# EAGLE design AlmosFinalMC (EAGLE 7.5.0)
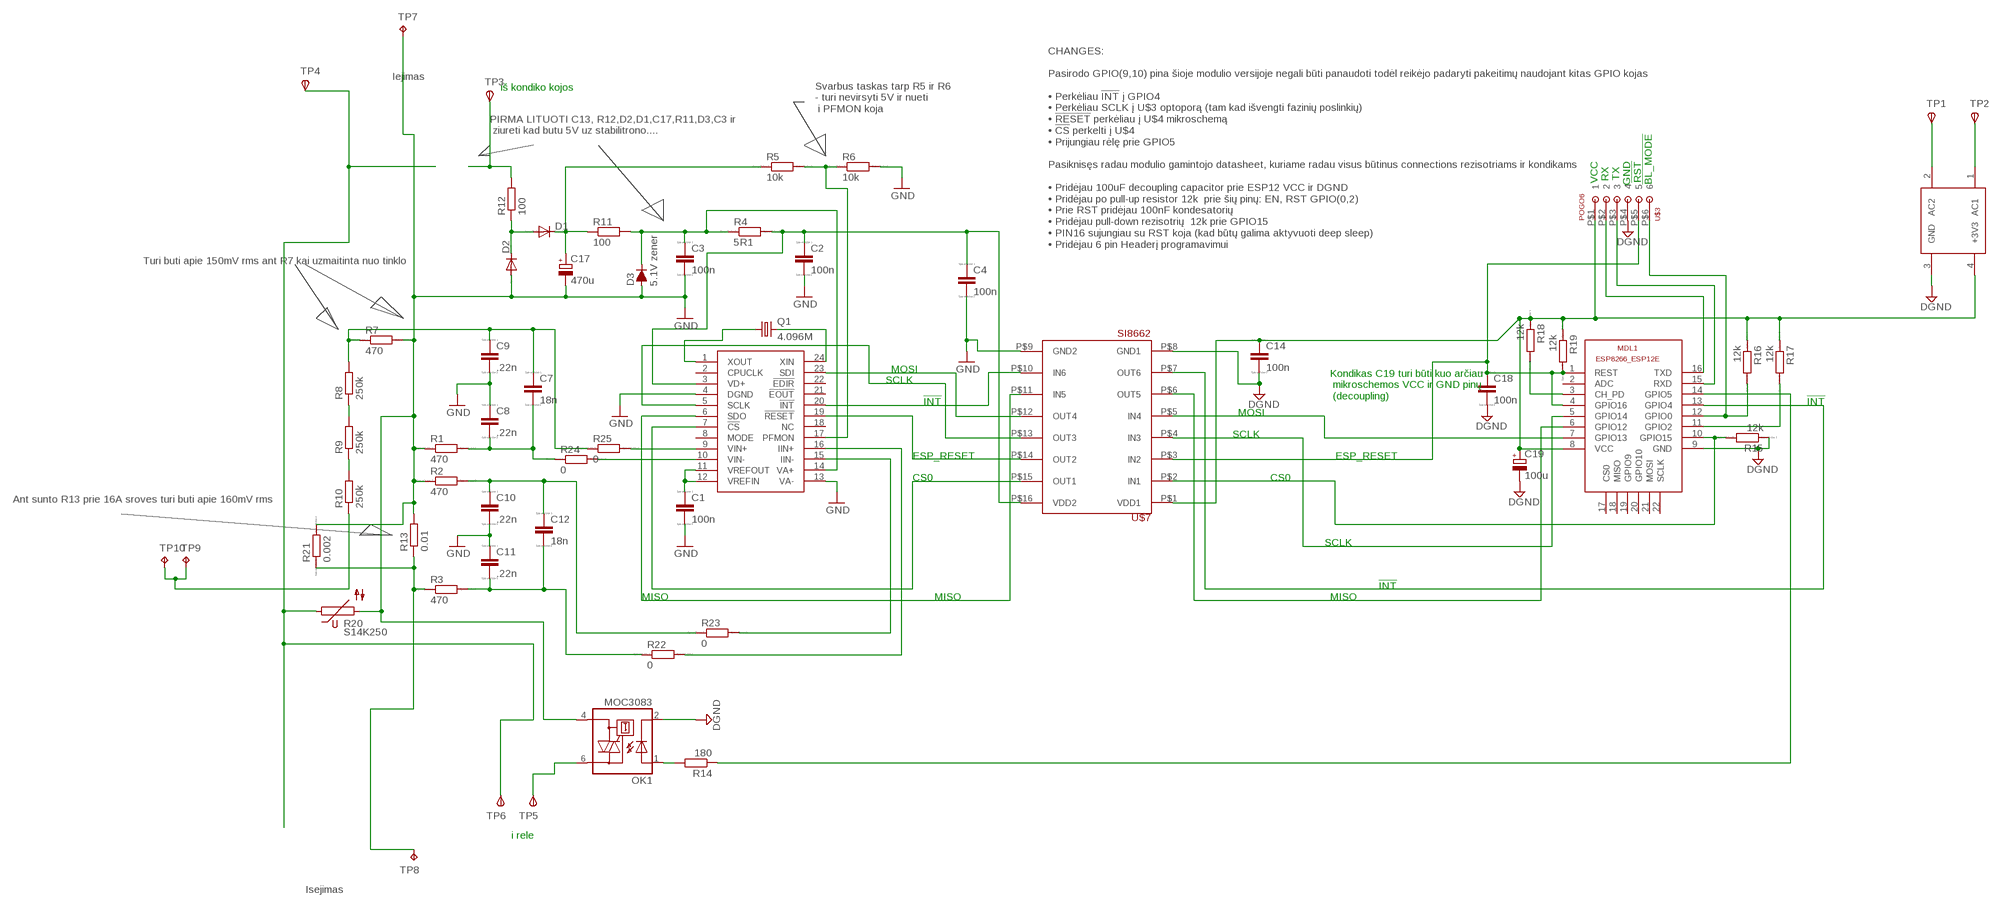
[diagram p0: schematic, sheet 1]

## Parts
C1  100n  CC0603  [C0603]
C2  100n  CC0603  [C0603]
C3  100n  CC0603  [C0603]
C4  100n  CC0603  [C0603]
C7  18n  CC0603  [C0603]
C8  .22n  CC0603  [C0603]
C9  .22n  CC0603  [C0603]
C10  .22n  CC0603  [C0603]
C11  .22n  CC0603  [C0603]
C12  18n  CC0603  [C0603]
C14  100n  CC0603  [C0603]
C17  470u  CPOL-EUG  [PANASONIC_G]
C18  100n  CC0603  [C0603]
C19  100u  CPOL-EUUD-4X5,8  [UD-4X5,8_NICHICON]
D1  DIODE-DO-214AC  [DO-214AC]
D2  DIODE-DO-214AC  [DO-214AC]
D3  5.1V zener  D-FILL-SOD123  [SOD123]
MDL1  ESP8266-12EESP8266-ESP12E  [ESP8266-ESP12E]
OK1  MOC3083  IL410  [DIL06]
Q1  4.096M  CRYSTALHC49UP  [HC49UP]
R1  470  RR0603  [R0603]
R2  470  RR0603  [R0603]
R3  470  RR0603  [R0603]
R4  5R1  R  [R0805]
R5  10k  RR0603  [R0603]
R6  10k  RR0603  [R0603]
R7  470  R  [R0805]
R8  250k  R-EU_0204/7  [0204/7]
R9  250k  R-EU_0204/7  [0204/7]
R10  250k  R-EU_0204/7  [0204/7]
R11  100  R-EU_0207/5V  [0207/5V]
R12  100  R-EU_0309/10  [0309/10]
R13  0.01  R-EU_V235/17  [V235/17]
R14  180  R-EU_R0603  [R0603]
R15  12k  RR0603  [R0603]
R16  12k  RR0603  [R0603]
R17  12k  RR0603  [R0603]
R18  12k  RR0603  [R0603]
R19  12k  RR0603  [R0603]
R20  S14K250  [S14K250]
R21  0.002  RR2512  [R2512]
R22  0  RR0603  [R0603]
R23  0  RR0603  [R0603]
R24  0  RR0603  [R0603]
R25  0  RR0603  [R0603]
TP1  TPSPAD1-13Y  [P1-13Y]
TP2  TPSPAD1-13Y  [P1-13Y]
TP3  TPSPAD1-13Y  [P1-13Y]
TP4  TPSPAD1-13Y  [P1-13Y]
TP5  TPSPAD1-13Y  [P1-13Y]
TP6  TPSPAD1-13Y  [P1-13Y]
TP7  TPPAD1-20  [P1-20]
TP8  TPPAD1-20  [P1-20]
TP9  TPPAD1-13  [P1-13]
TP10  TPPAD1-13  [P1-13]
U$1  CS5460A  [SSOP24]
U$3  POGO6  [POGO6]
U$5  RAC02  [RAC02]
U$7  SI8662  [SOIC8]

## Nets
DGND: C14.2 C18.2 C19.- MDL1.9(GND) OK1.2(C) R15.1 U$3.P$4 U$5.3(GND) U$7.P$8(GND1)
GND: C1.2 C2.2 C3.2 C4.2 C8.1 C9.2 C10.2 C11.1 C17.- D2.A D3.2(A) OK1.4(A1) R1.1 R2.1 R6.2 R7.2 R13.2 R20.2 R21.2 TP7.TP U$1.4(DGND) U$1.13(VA-) U$7.P$9(GND2)
N$1: C3.1 D3.1(C) R4.1 R11.2 U$1.14(VA+)
N$2: C2.1 C4.1 R4.2 U$1.3(VD+) U$7.P$16(VDD2)
N$3: R5.2 R6.1 U$1.17(PFMON)
N$4: C7.1 C9.1 R7.1 R8.2 R25.1
N$5: U$1.23(SDI) U$7.P$12(OUT4)
N$6: C7.2 C8.2 R1.2 R24.1
N$7: C17.+ D1.C R5.1 R11.1
N$8: D1.A D2.C R12.1
N$9: MDL1.14(GPIO5) R14.1
N$10: C10.1 C12.1 R2.2 R23.1
N$11: R22.2 U$1.16(IIN+)
N$12: MDL1.16(TXD) U$3.P$2
N$13: C1.1 U$1.11(VREFOUT) U$1.12(VREFIN)
N$14: U$1.20(!INT!) U$7.P$10(IN6)
N$15: U$1.6(SDO) U$7.P$11(IN5)
N$16: R3.1 R13.1 R21.1 TP8.TP
N$17: R20.1 TP4.TP(PP) TP6.TP(PP)
N$18: R8.1 R9.2
N$19: R9.1 R10.2
N$20: R12.2 TP3.TP(PP)
N$21: MDL1.6(GPIO12) U$7.P$6(OUT5)
N$22: MDL1.15(RXD) U$3.P$3
N$23: U$1.7(!CS!) U$7.P$15(OUT1)
N$24: U$1.5(SCLK) U$7.P$13(OUT3)
N$25: U$1.19(!RESET!) U$7.P$14(OUT2)
N$26: R23.2 U$1.15(IIN-)
N$27: MDL1.11(GPIO2) R17.2
N$28: TP1.TP(PP) U$5.2(AC2)
N$29: C14.1 C19.+ MDL1.8(VCC) R16.1 R17.1 R18.1 R19.1 U$3.P$1 U$5.4(+3V3) U$7.P$1(VDD1)
N$30: TP2.TP(PP) U$5.1(AC1)
N$31: Q1.1 U$1.1(XOUT)
N$32: Q1.2 U$1.24(XIN)
N$33: MDL1.5(GPIO14) U$7.P$4(IN3)
N$34: MDL1.10(GPIO15) R15.2 U$7.P$2(IN1)
N$35: OK1.1(A) R14.2
N$36: MDL1.7(GPIO13) U$7.P$5(IN4)
N$37: MDL1.3(CH_PD) R18.2
N$38: C11.2 C12.2 R3.2 R22.1
N$39: MDL1.13(GPIO4) U$7.P$7(OUT6)
N$40: R24.2 U$1.10(VIN-)
N$41: R25.2 U$1.9(VIN+)
N$42: OK1.6(A2) TP5.TP(PP)
N$43: MDL1.12(GPIO0) R16.2 U$3.P$6
N$44: R10.1 TP9.TP TP10.TP
N$45: C18.1 MDL1.1(REST) MDL1.4(GPIO16) R19.2 U$3.P$5 U$7.P$3(IN2)
Unconnected: MDL1.2(ADC) MDL1.17(CS0) MDL1.18(MISO) MDL1.19(GPIO9) MDL1.20(GPIO10) MDL1.21(MOSI) MDL1.22(SCLK) U$1.2(CPUCLK) U$1.8(MODE) U$1.18(NC) U$1.21(!EOUT!) U$1.22(!EDIR!)

## Notes on the sheet
- Iejimas
- iš kondiko kojos
- Svarbus taskas tarp R5 ir R6 
  - turi nevirsyti 5V ir nueti
   i PFMON koja
- PIRMA LITUOTI C13, R12,D2,D1,C17,R11,D3,C3 ir
   ziureti kad butu 5V uz stabilitrono....
- !BL_MODE!
- VCC | GND | !RST!
- RX | TX
- CHANGES:
  
  Pasirodo GPIO(9,10) pina šioje modulio versijoje negali būti panaudoti todėl reikėjo padaryti pakeitimų naudojant kitas GPIO kojas
  
  • Perkėliau !INT! į GPIO4
  • Perkėliau SCLK į U$3 optoporą (tam kad išvengti fazinių poslinkių)
  • !RESET! perkėliau į U$4 mikroschemą
  • !CS! perkelti į U$4
  • Prijungiau rėlę prie GPIO5
  
  Pasiknisęs radau modulio gamintojo datasheet, kuriame radau visus būtinus connections rezisotriams ir kondikams
  
  • Pridėjau 100uF decoupling capacitor prie ESP12 VCC ir DGND
  • Pridėjau po pull-up resistor 12k  prie šių pinų: EN, RST GPIO(0,2) 
  • Prie RST pridėjau 100nF kondesatorių 
  • Pridėjau pull-down rezisotrių  12k prie GPIO15
  • PIN16 sujungiau su RST koja (kad būtų galima aktyvuoti deep sleep)
  • Pridėjau 6 pin Headerį programavimui
- Turi buti apie 150mV rms ant R7 kai uzmaitinta nuo tinklo
- MOSI
- SCLK
- Kondikas C19 turi būti kuo arčiau
   mikroschemos VCC ir GND pinų
   (decoupling)
- !INT! | !INT!
- MOSI
- SCLK
- ESP_RESET | ESP_RESET
- CS0 | CS0
- Ant sunto R13 prie 16A sroves turi buti apie 160mV rms
- SCLK
- !INT!
- MISO | MISO | MISO
- i rele
- Isejimas

## Library data of the parts
C1-C4 C7-C12 C14 C18 = eagle-ltspice:C: CAPACITOR, European symbol; SPICEMODEL: NONE; SPICEPREFIX: C
C17 C19 = rcl:CPOL-EU: POLARIZED CAPACITOR, European symbol
D1 D2 = diode:DIODE-: DIODE
D3 = semicon-smd-ipc:D-FILL-: DIODE filled
MDL1 = ESP8266-ESP12E:ESP8266-12E: ESP8266-12E with additional I/O and GPIO04/05 corrected The author cannot warrant that this library is free from error or will meet your specific requirements. Created by PuceBaboon.com. Komagane, Nagano, JAPAN
OK1 = optocoupler:IL410: SIEMENS OPTO COUPLER; MF: VISHAY/TELEFUNKEN; MPN: IL410; OC_FARNELL: 1045434; OC_NEWARK: 58K1715
Q1 = crystal:CRYSTAL: CRYSTAL; OC_FARNELL: unknown; OC_NEWARK: unknown
R1-R7 R15-R19 R21-R25 = eagle-ltspice:R: RESISTOR, European symbol; SPICEMODEL: NONE; SPICEPREFIX: R
R8-R14 = resistor:R-EU_: RESISTOR, European symbol
R20 = varistor:S14K250: VARISTOR
TP1-TP6 = testpad:TPS: TEST PIN
TP7-TP10 = testpad:TP: Test pad
U$1 = CS5460Apwr:CS5460A
U$3 = Pogo:POGO6
U$5 = RAC02:RAC02
U$7 = Si8662:SI8662

## Net classes
0 default: width 0.254 mm, drill 0.762 mm, clearance 0.152 mm

## Board
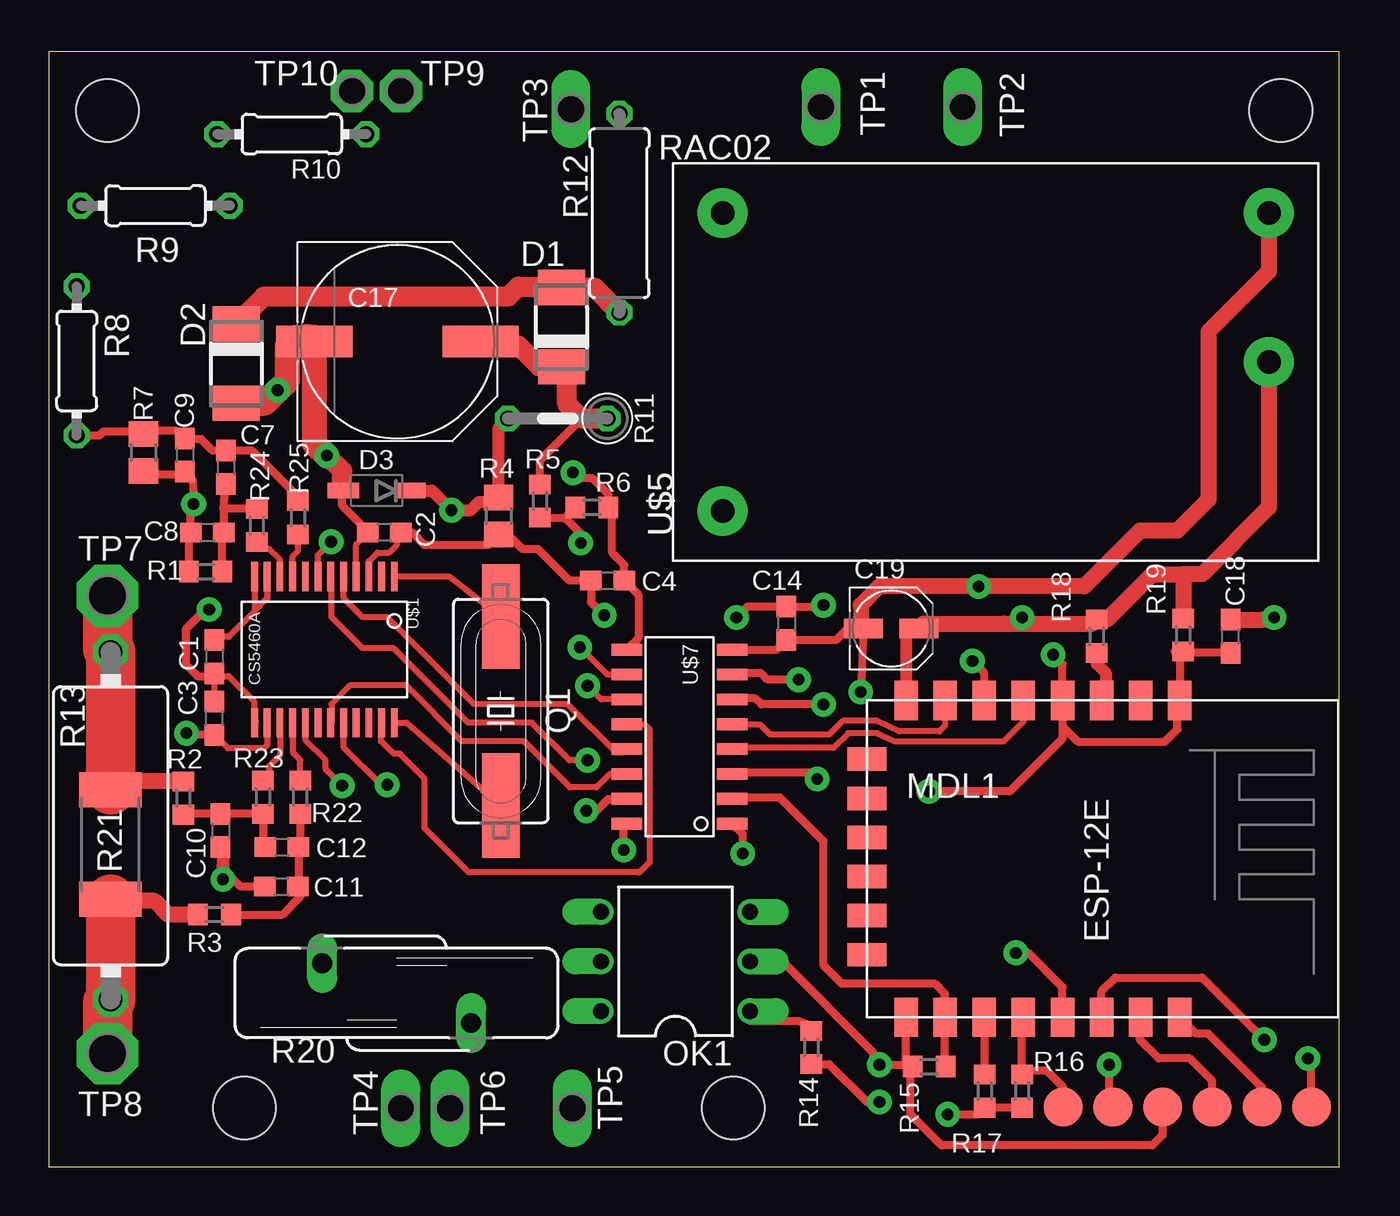
[diagram p1: board, top side]
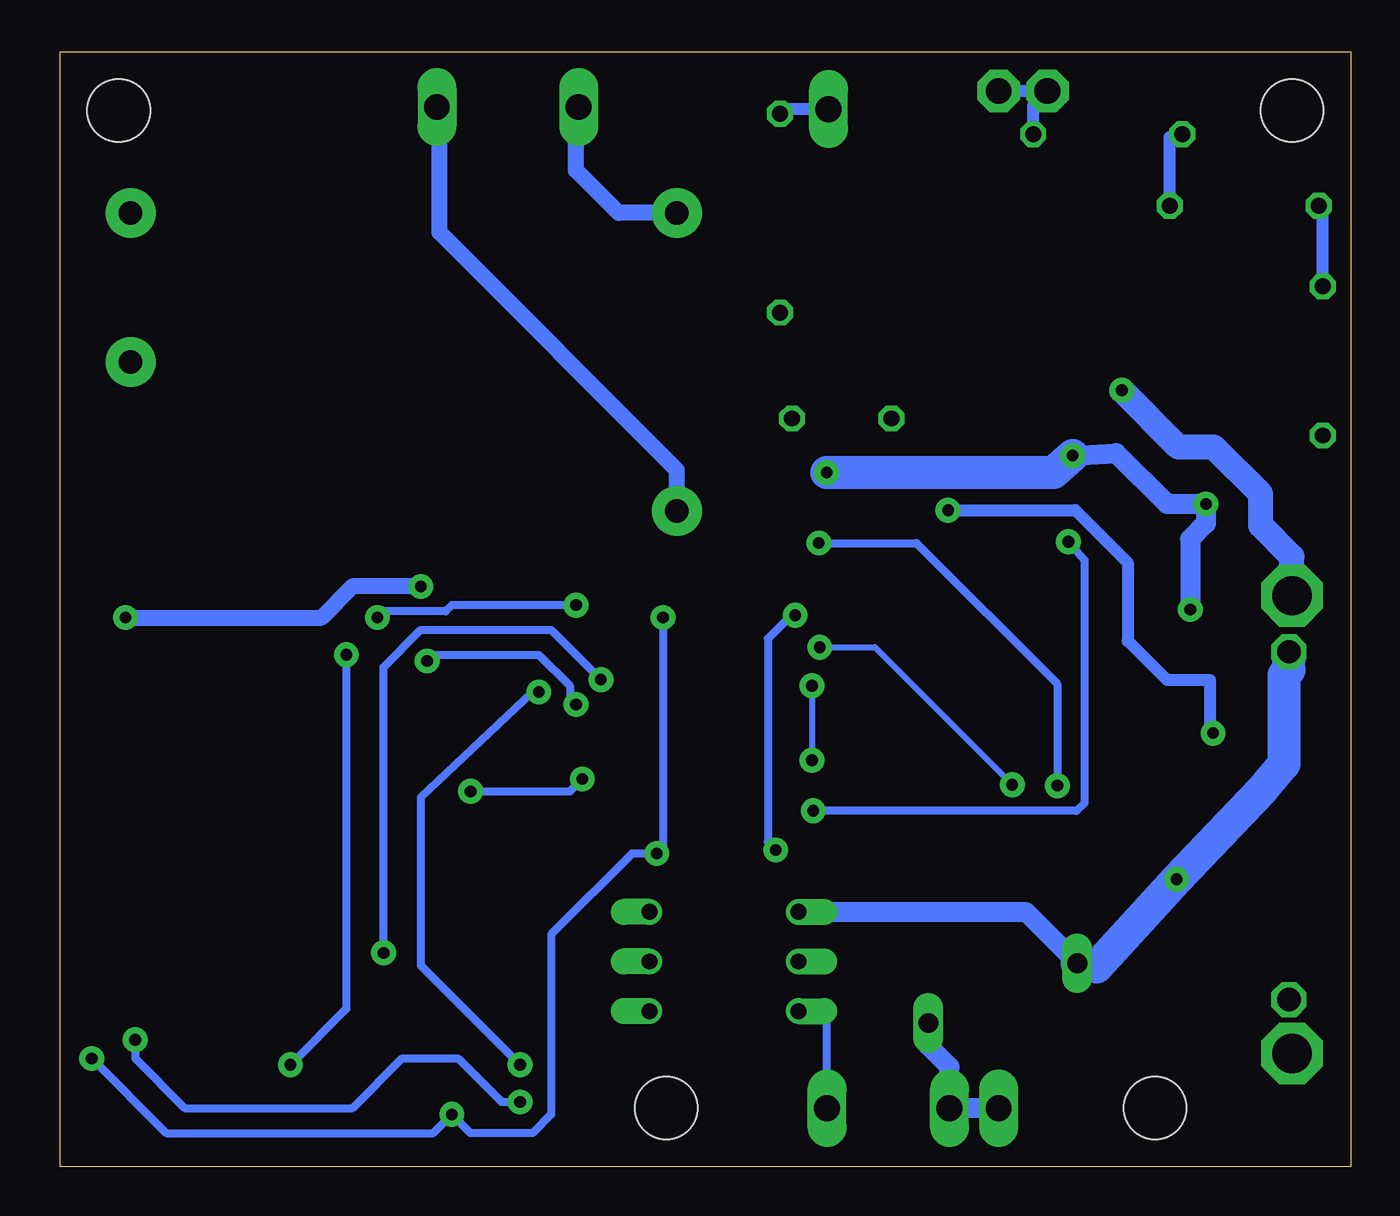
[diagram p2: board, bottom side, seen from below]

Size 66 x 57 mm. Coordinates in mm from the lower left corner, seen from the top.
Outline: 0,0 66,0 66,57 0,57 0,0
Copper layers (1*16): Top 0.035mm / dielectric 1.5mm / Bottom 0.035mm
Design rules "default": minimum track width 10mil, minimum drill 24mil, track to track 8mil, track to pad 8mil, pad to pad 8mil, via to via 8mil, smd to smd 8mil, copper to edge 40mil, drill to drill 8mil, minimum pad ring 10mil, minimum via ring 8mil, stop-mask expansion 4mil, vias tented up to drill 0mil, thermal gap 10mil
Holes 3.2 mm at 3,54 63,54 35,3 10,3

### Footprints (pad centres in the part's own frame; a part is rotated, then mirrored left to right if it is on the bottom)
C0603 = smd 1.1 x 1: 1 -0.85,0; 2 0.85,0
PANASONIC_G = smd 3.9 x 1.6: + 4.25,0; - -4.25,0
UD-4X5,8_NICHICON = smd 2 x 1: + 1.425,0; - -1.425,0
DO-214AC = smd 1.8 x 2.4: A 2.025,0; C -2.025,0
SOD123 = smd 1.6 x 0.8: 1 -1.7,0; 2 1.7,0
ESP8266-ESP12E = smd 2 x 1.2: 1 0,16; 2 0,14; 3 0,12; 4 0,10; 5 0,8; 6 0,6; 7 0,4; 8 0,2; 9 16.2,2; 10 16.2,4; 11 16.2,6; 12 16.2,8; 13 16.2,10; 14 16.2,12; 15 16.2,14; 16 16.2,16 | smd 1.2 x 2: 17 11,0; 18 3,0; 19 5,0; 20 13,0; 21 7,0; 22 9,0
DIL06 = drill 0.813 offset: 1 -2.54,-3.81; 2 0,-3.81; 3 2.54,-3.81; 4 2.54,3.81; 5 0,3.81; 6 -2.54,3.81
HC49UP = smd 5.334 x 1.93: 1 -4.826,0; 2 4.826,0
R0603 = smd 1 x 1.1: 1 -0.85,0; 2 0.85,0
R0805 = smd 1.3 x 1.5: 1 -0.95,0; 2 0.95,0
0204/7 = drill 0.813 octagon: 1 -3.81,0; 2 3.81,0
0207/5V = drill 0.813 octagon: 1 -2.54,0; 2 2.54,0
0309/10 = drill 0.813 octagon: 1 -5.08,0; 2 5.08,0
V235/17 = drill 1.194 octagon: 1 -8.89,0; 2 8.89,0
S14K250 = drill 1.016 long: 1 -1.524,-3.81; 2 1.524,3.81
R2512 = smd 1.8 x 3.2: 1 -2.8,0; 2 2.8,0
P1-13Y = drill 1.321 pad 1.905 long: TP 0,0
P1-20 = drill 2.007 pad 3.15 octagon: TP 0,0
P1-13 = drill 1.321 pad 2.159 octagon: TP 0,0
SSOP24 = smd 1.5 x 0.35: 1 -3.9,3.25; 2 -3.9,2.6; 3 -3.9,1.95; 4 -3.9,1.3; 5 -3.9,0.65; 6 -3.9,0; 7 -3.9,-0.65; 8 -3.9,-1.3; 9 -3.9,-1.95; 10 -3.9,-2.6; 11 -3.9,-3.25; 12 -3.9,-3.9; 13 3.575,-3.9; 14 3.575,-3.25; 15 3.575,-2.6; 16 3.575,-1.95; 17 3.575,-1.3; 18 3.575,-0.65; 19 3.575,0; 20 3.575,0.65; 21 3.575,1.3; 22 3.575,1.95; 23 3.575,2.6; 24 3.575,3.25
POGO6 = smd 2 x 2: P$1 0,7.62; P$2 0,5.08; P$3 0,2.54; P$4 0,0; P$5 0,-2.54; P$6 0,-5.08
RAC02 = drill 1.2 pad 2.54: 1 -12.7,-7.62; 2 -12.7,7.62; 3 15.24,7.62; 4 15.24,0
SOIC8 = smd 1.55 x 0.6: P$1 -2.54,4.128; P$2 -2.54,2.857; P$3 -2.54,1.587; P$4 -2.54,0.318; P$5 -2.54,-0.953; P$6 -2.54,-2.223; P$7 -2.54,-3.493; P$8 -2.54,-4.763; P$9 2.857,-4.763; P$10 2.857,-3.493; P$11 2.857,-2.223; P$12 2.857,-0.953; P$13 2.857,0.318; P$14 2.857,1.587; P$15 2.857,2.857; P$16 2.857,4.128

### Placement (x,y rotation side)
C1  8.47,26.08 270 top
C2  17.16,32.43 180 top
C3  8.47,22.94 90 top
C4  28.57,29.97 0 top
C7  9.05,35.76 270 top
C8  8.11,32.44 0 top
C9  6.95,36.4 270 top
C10  8.78,17.19 270 top
C11  11.9,14.33 0 top
C12  11.92,16.34 0 top
C14  37.72,27.79 270 top
C17  17.83,42.19 0 top
C18  60.43,27.12 90 top
C19  43.08,27.52 0 top
D1  26.21,42.93 90 top
D2  9.59,41.07 270 top
D3  16.76,34.57 180 top
MDL1  41.83,23.84 270 top
OK1  32.05,10.5 90 top
Q1  23.11,23.31 270 top
R1  8.02,30.43 0 top
R2  6.88,18.85 270 top
R3  8.47,12.9 0 top
R4  23,33.28 270 top
R5  25.12,34.04 270 top
R6  27.77,33.72 0 top
R7  4.84,36.52 270 top
R8  1.42,41.2 270 top
R9  5.44,49.14 180 top
R10  12.42,52.8 180 top
R11  26.02,38.26 180 top
R12  29.17,48.75 90 top
R13  3.16,17.44 90 top
R14  38.99,6.1 90 top
R15  45.02,5.12 0 top
R16  49.77,3.87 90 top
R17  47.87,3.87 90 top
R18  53.59,27.12 270 top
R19  58.01,27.19 270 top
R20  17.79,8.88 90 top
R21  3.16,16.48 90 top
R22  12.86,18.9 90 top
R23  10.95,18.9 90 top
R24  10.64,32.79 270 top
R25  12.74,33.19 270 top
TP1  39.48,54.18 180 top
TP2  46.73,54.18 180 top
TP3  26.7,54.08 0 top
TP4  18,3 0 top
TP5  26.78,3 0 top
TP6  20.51,3 0 top
TP7  3,29.2 0 top
TP8  3,5.8 0 top
TP9  18,55 0 top
TP10  15.5,55 0 top
U$1  14.42,26.28 270 top
U$3  56.95,3.07 270 top
U$5  47.15,41.15 0 top
U$7  32.41,21.67 180 top

### Tracks (layer width: path | path; a pad name or v marks a point on that pad's centre or on a via)
DGND  (via drill 0.6 pad 1.27)
  Top 0.406: 43.83,5.12 R15.1 44.06,5.01 44.06,2.68 45.64,1.1 56.44,1.1 56.95,1.61 U$3.P$4 | 43.83,5.12 MDL1.9 | C19.- 41.65,27.58 v41.52,24.27 | 43.83,5.12 43.73,5.23 v42.47,5.23 42.15,5.54 42.15,5.86 37.51,10.5 OK1.2 | 41.52,27.66 40.99,27.66 40.28,26.94 C14.2 37.21,26.44 U$7.P$8
  Top 0.61: MDL1.9 43.83,6.91
  Top 0.813: U$5.3 62.39,45.78 59.3,42.69 59.3,34.12 57.71,32.53 55.81,32.53 52.95,29.67 v47.55,29.67 42.47,29.67 41.52,28.72 41.52,27.66 C19.- | C18.2 62.05,27.98 v62.66,28.09
  Bottom 0.406: v41.52,24.27 41.83,24.27 47.55,18.88 47.55,10.3 v42.47,5.23
  Bottom 0.813: v62.66,28.09 52.63,28.09 51.04,29.67 v47.55,29.67
GND  (via drill 0.6 pad 1.27)
  Top 0.305: 10.6,22.79 U$1.13 10.52,23.77 9.2,25.09 8.43,25.09 | 8.07,25.13 C1.2 8.47,25.13 C3.2 | U$1.4 15.72,31.84 C2.2
  Top 0.406: v8.2,28.49 8,28.49 7,27.49 7,25.69 7.6,25.09 8.43,25.09 C1.2 | C11.1 9.81,14.33 9.05,15.09 9.05,16.07 C10.2 8.78,15.38 v8.9,14.7 | R7.2 5.4,35.56 5.56,35.41 6.88,35.41 C9.2 7.35,35.14 v7.4,33.89 7.26,33.43 C8.1 7.17,32.34 R1.1 | C2.2 16.31,32.49 15,33.8 15,34.63 D3.2 | v26.8,35.49 27.09,35.2 27.8,35.2 28.62,34.38 R6.2 28.8,33.53 28.8,31.4 29.42,30.78 C4.2 30.15,29.24 30.15,27.04 U$7.P$9 | 15.14,34.81 15.14,35.45 v14.22,36.36
  Top 0.61: 15.23,34.81 15.14,34.81
  Top 0.813: R2.1 3.58,19.7 R21.2
  Top 1.016: 15,34.63 15,35.58 v14.22,36.36
  Top 1.27: v14.22,36.36 13.58,37.01 C17.- 13.37,42.4 12.6,42.4 12.2,42 12.2,40.2 v11.7,39.7 11.04,39.04 D2.A
  Top 1.676: C17.- 13.18,42.25
  Top 2.54: R21.2 R13.2 3,26.49 TP7.TP
  Bottom 1.016: v14.22,36.36 12,36.49 9.4,33.89 v7.4,33.89 7.4,32.89 8.2,32.09 v8.2,28.49 | OK1.4 16.61,13.04 R20.2
  Bottom 1.27: TP7.TP 3,31.2 4.6,32.8 4.6,34.4 7,36.8 8.8,36.8 v11.7,39.7
  Bottom 1.676: v14.22,36.36 15.2,35.49 v26.8,35.49 | R20.2 12.98,10.22 v8.9,14.7 4.5,19.3 3.4,20.6 3.4,25.15 3.15,25.4 3.15,25.93 R13.2
N$1  (via drill 0.6 pad 1.27)
  Top 0.305: U$1.14 11.17,21.57 11,21.4 9.16,21.4 C3.1
  Top 0.406: C3.1 7.12,22.09 v7.03,22.17
  Top 0.61: D3.1 19.59,34.57 v20.59,33.57 21.57,33.57 22,34 22.77,34 R4.1 23,37.77 R11.2
  Bottom 0.61: v20.59,33.57 14.08,33.57 11.4,30.89 11.4,26.89 9.4,24.89 7.2,24.89 7.2,22.34 v7.03,22.17
N$2  (via drill 0.6 pad 1.27)
  Top 0.305: U$1.3 16.37,30.97 16.8,31.4 17.4,31.4 17.8,31.8 17.8,32.23 C2.1
  Top 0.406: C2.1 18.57,32.43 19.2,31.8 22.47,31.8 R4.2 23.47,32.33 24.2,31.6 25,31.6 26.6,30 27.69,30 C4.1 27.72,28.88 v28.4,28.2 | v29.4,16.2 29.4,17.4 U$7.P$16
  Bottom 0.406: v28.4,28.2 28.6,28.2 29.8,27 29.8,16.6 v29.4,16.2
N$3  (via drill 0.6 pad 1.27)
  Top 0.305: U$1.17 13.12,21.82 14.13,20.8 14.13,20.36 v15,19.49
  Top 0.406: R5.2 26.39,33.19 | 26.39,33.19 R6.1 | v27.2,31.89 27.2,32.39 26.39,33.19
  Bottom 0.406: v27.2,31.89 22.2,31.89 15,24.69 v15,19.49
N$4
  Top 0.406: R8.2 2.59,37.39 2.8,37.6 5.1,37.6 R7.1 4.81,37.63 6.51,37.63 6.95,37.2 C9.1 6.99,37.2 7.8,37.2 8.39,36.61 C7.1 9.07,36.6 10.4,36.6 12.74,34.26 R25.1
N$5
  Top 0.305: U$7.P$12 30.47,22.63 30.72,22.37 30.72,15.57 30.2,15.05 21.47,15.05 19.21,17.31 19.21,19.85 17.94,21.12 17.62,21.12 16.99,21.76 16.99,22.68 U$1.23
N$6
  Top 0.406: R24.1 8.93,33.64 C7.2 8.96,34.02 C8.2 8.87,32.34 R1.2
N$7
  Top 0.406: R5.1 25.12,36.13 27.24,38.26
  Top 1.016: R11.1 27.24,38.26 26.5,39 26.5,40.62 D1.C 25.09,40.91 24,42 22.27,42 C17.+
N$8
  Top 1.016: D2.C 11,44.5 23.5,44.5 24,45 26.17,45 D1.A 27.89,44.96 R12.1
N$9  (via drill 0.6 pad 1.27)
  Top 0.406: MDL1.14 53.83,8.97 54.53,9.67 58.98,9.67 v62.16,6.5 | R14.1 39.9,5.25 41.83,3.32 v42.47,3.32
  Bottom 0.406: v62.16,6.5 62.16,5.54 59.61,3 51.04,3 48.5,5.54 45.64,5.54 43.42,3.32 v42.47,3.32
N$10
  Top 0.406: C12.1 10.95,16.46 R23.1 C10.1 6.92,18.04 R2.2
N$11
  Top 0.305: R22.2 12.86,20.8 12.47,21.2 U$1.16
N$12
  Top 0.406: U$3.P$2 62.03,4.08 59.3,6.81 58.67,6.81 MDL1.16
N$13
  Top 0.305: U$1.11 11.17,29.06 10.52,28.41 | 10.52,28.41 9.2,27.09 8.13,27.09 C1.1 | U$1.12 10.52,28.41
N$14  (via drill 0.6 pad 1.27)
  Top 0.254: 15.03,22.93 U$1.20
  Top 0.305: U$7.P$10 28.56,25.17 27.55,26.18 v27.15,26.57 | v17.3,19.53 16.99,19.53 15.08,21.44 15.08,22.69 U$1.20
  Bottom 0.305: v27.15,26.57 24.34,26.57 v17.3,19.53
N$15  (via drill 0.6 pad 1.27)
  Top 0.305: U$7.P$11 28.24,23.9 v27.55,24.59 | U$1.6 14.45,30.15 14.45,28.11 16.03,26.52 17.62,26.52 21.43,22.71 24.69,22.71 26.62,20.78 v27.55,20.78
  Bottom 0.305: v27.55,24.59 v27.55,20.78
N$16
  Top 0.813: R3.1 6.1,12.9 5.4,13.6 3.23,13.6 R21.1
  Top 2.54: TP8.TP 3,8.39 R13.1 R21.1
N$17
  Bottom 1.016: R20.1 21.6,6.2 20.51,5.11 TP6.TP TP4.TP
N$18
  Bottom 0.61: R8.1 1.42,48.85 R9.2
N$19
  Bottom 0.61: R9.1 9.25,52.66 R10.2
N$20
  Bottom 0.61: TP3.TP 28.93,54.08 R12.2
N$21  (via drill 0.6 pad 1.27)
  Top 0.406: MDL1.6 47.83,25.26 v47.23,25.86 | v39.61,23.64 36.44,23.64 36.12,23.96 35,23.96 U$7.P$6
  Bottom 0.406: v47.23,25.86 46.92,26.18 41.52,26.18 39.93,24.59 39.93,23.96 v39.61,23.64
N$22
  Top 0.406: U$3.P$3 59.49,4.39 58.34,5.54 56.76,5.54 55.81,6.5 55.81,7.61 MDL1.15
N$23  (via drill 0.6 pad 1.27)
  Top 0.305: U$1.7 13.77,31.29 v14.43,31.95
  Top 0.406: v27.48,18.2 28,18.2 28.6,18.8 29.53,18.8 U$7.P$15
  Bottom 0.406: v14.43,31.95 13.6,31.02 13.6,18.6 14,18.2 v27.48,18.2
N$24
  Top 0.305: U$1.5 15.08,30.17 15.08,29.06 16.03,28.11 17.3,28.11 21.75,23.66 26.54,23.66 29,21.2 29.39,21.2 U$7.P$13
N$25
  Top 0.305: U$1.19 14.45,22.74 14.45,23.66 15.4,24.62 18.26,24.62 21.12,21.76 24.29,21.76 26.65,19.4 28,19.4 28.69,20.09 U$7.P$14
N$26
  Top 0.305: U$1.15 11.82,21.03 11.27,20.49 11.27,20.07 R23.2
N$27
  Top 0.406: R17.2 47.87,7.61 MDL1.11
N$28
  Bottom 0.813: U$5.2 37.44,48.77 39.61,50.94 39.61,53.17 39.3,53.48 39.3,54 TP1.TP
N$29  (via drill 0.6 pad 1.27)
  Top 0.406: R16.1 R17.1 47.53,2.68 v45.96,2.68 | v35.17,28.09 35.72,28.64 C14.1 39.53,28.64 v39.61,28.72 | v35.48,16.02 35.48,17.01 U$7.P$1 | U$3.P$1 64.57,5.35 v64.38,5.54 | 48.82,27.77 49.45,27.77 v49.77,28.09
  Top 0.61: C19.+ 43.83,27.52 MDL1.8
  Top 0.813: C19.+ 44.74,27.77 48.82,27.77 53.38,27.77 R18.1 54.11,27.98 56.44,30.31 58.03,30.31 | 58.03,30.31 58.98,30.31 62.39,33.72 U$5.4 | 58.03,30.31 58.03,29.32 R19.1
  Bottom 0.406: v35.17,28.09 35.17,16.34 v35.48,16.02 36.75,16.02 40.88,11.89 40.88,2.68 41.83,1.73 45.01,1.73 v45.96,2.68 46.92,1.73 60.57,1.73 v64.38,5.54 | v39.61,28.72 45.96,28.72 46.28,28.4 49.45,28.4 v49.77,28.09 50.09,27.77
N$30
  Bottom 0.813: U$5.1 34.45,35.62 46.6,47.77 46.6,54.05 TP2.TP
N$31
  Top 0.305: U$1.1 20.46,30.18 Q1.1
N$32
  Top 0.305: U$1.24 18.28,22.71 Q1.2
N$33
  Top 0.305: MDL1.5 49.83,22.75 48.82,21.73 43.29,21.73 42.35,22.17 40.88,22.17 40.13,21.42 35,21.42 U$7.P$4
N$34
  Top 0.406: R15.2 45.83,5.12 MDL1.10 45.83,8.84 45.33,9.35 40.56,9.35 39.61,10.3 39.61,16.66 37.39,18.88 35,18.88 U$7.P$2
N$35
  Top 0.406: R14.2 38.84,7.27 38.34,7.45 35.87,7.45 OK1.1
N$36
  Top 0.305: MDL1.7 45.83,22.56 45.55,22.27 43.5,22.27 42.37,22.8 40.61,22.8 39.9,22.1 36.9,22.1 36.4,22.6 34.97,22.6 U$7.P$5 35,22.69
N$37
  Top 0.61: R18.2 53.59,25.71 54.05,25.25 54.05,24.06 MDL1.3
N$38
  Top 0.406: R22.1 12.86,16.43 C12.2 12.77,14.36 C11.2 12.86,14.22 12.86,13.82 11.94,12.9 R3.2
N$39  (via drill 0.6 pad 1.27)
  Top 0.406: MDL1.13 51.83,9.2 50.09,10.94 v49.45,10.94 | v38.34,24.91 36.75,24.91 36.44,25.23 35,25.23 U$7.P$7
  Bottom 0.406: v49.45,10.94 49.45,25.55 47.55,27.45 40.88,27.45 v38.34,24.91
N$40
  Top 0.305: U$1.10 11.82,31.05 11.27,31.6 10.95,31.6 10.64,31.92 R24.2
N$41
  Top 0.305: U$1.9 12.47,31.21 12.74,31.48 R25.2
N$42
  Bottom 0.406: TP5.TP 26.78,7.58 27,7.8 28.07,7.8 OK1.6
N$43
  Top 0.406: MDL1.12 49.77,7.58 R16.2 49.96,4.91 51.04,4.91 51.87,4.08 U$3.P$6
N$44
  Bottom 0.61: R10.1 16.23,54.27 TP10.TP TP9.TP
N$45  (via drill 0.6 pad 1.27)
  Top 0.406: R19.2 57.58,26.34 C18.1 57.83,26.27 MDL1.1 57.71,23.72 57.71,22.37 57.08,21.73 52.63,21.73 51.83,22.53 | v51.36,26.18 51.83,25.7 MDL1.4 51.83,22.53 | v54.22,5.23 54.22,3.9 U$3.P$5 | 51.83,22.53 51.83,21.89 49.14,19.2 v45.01,19.2 | v39.3,19.83 38.98,20.15 35,20.15 U$7.P$3
  Bottom 0.406: v51.36,26.18 51.36,8.08 v54.22,5.23 | v45.01,19.2 39.93,19.2 v39.3,19.83